# EAGLE design USB_Audio_Interface (EAGLE 9.6.2)
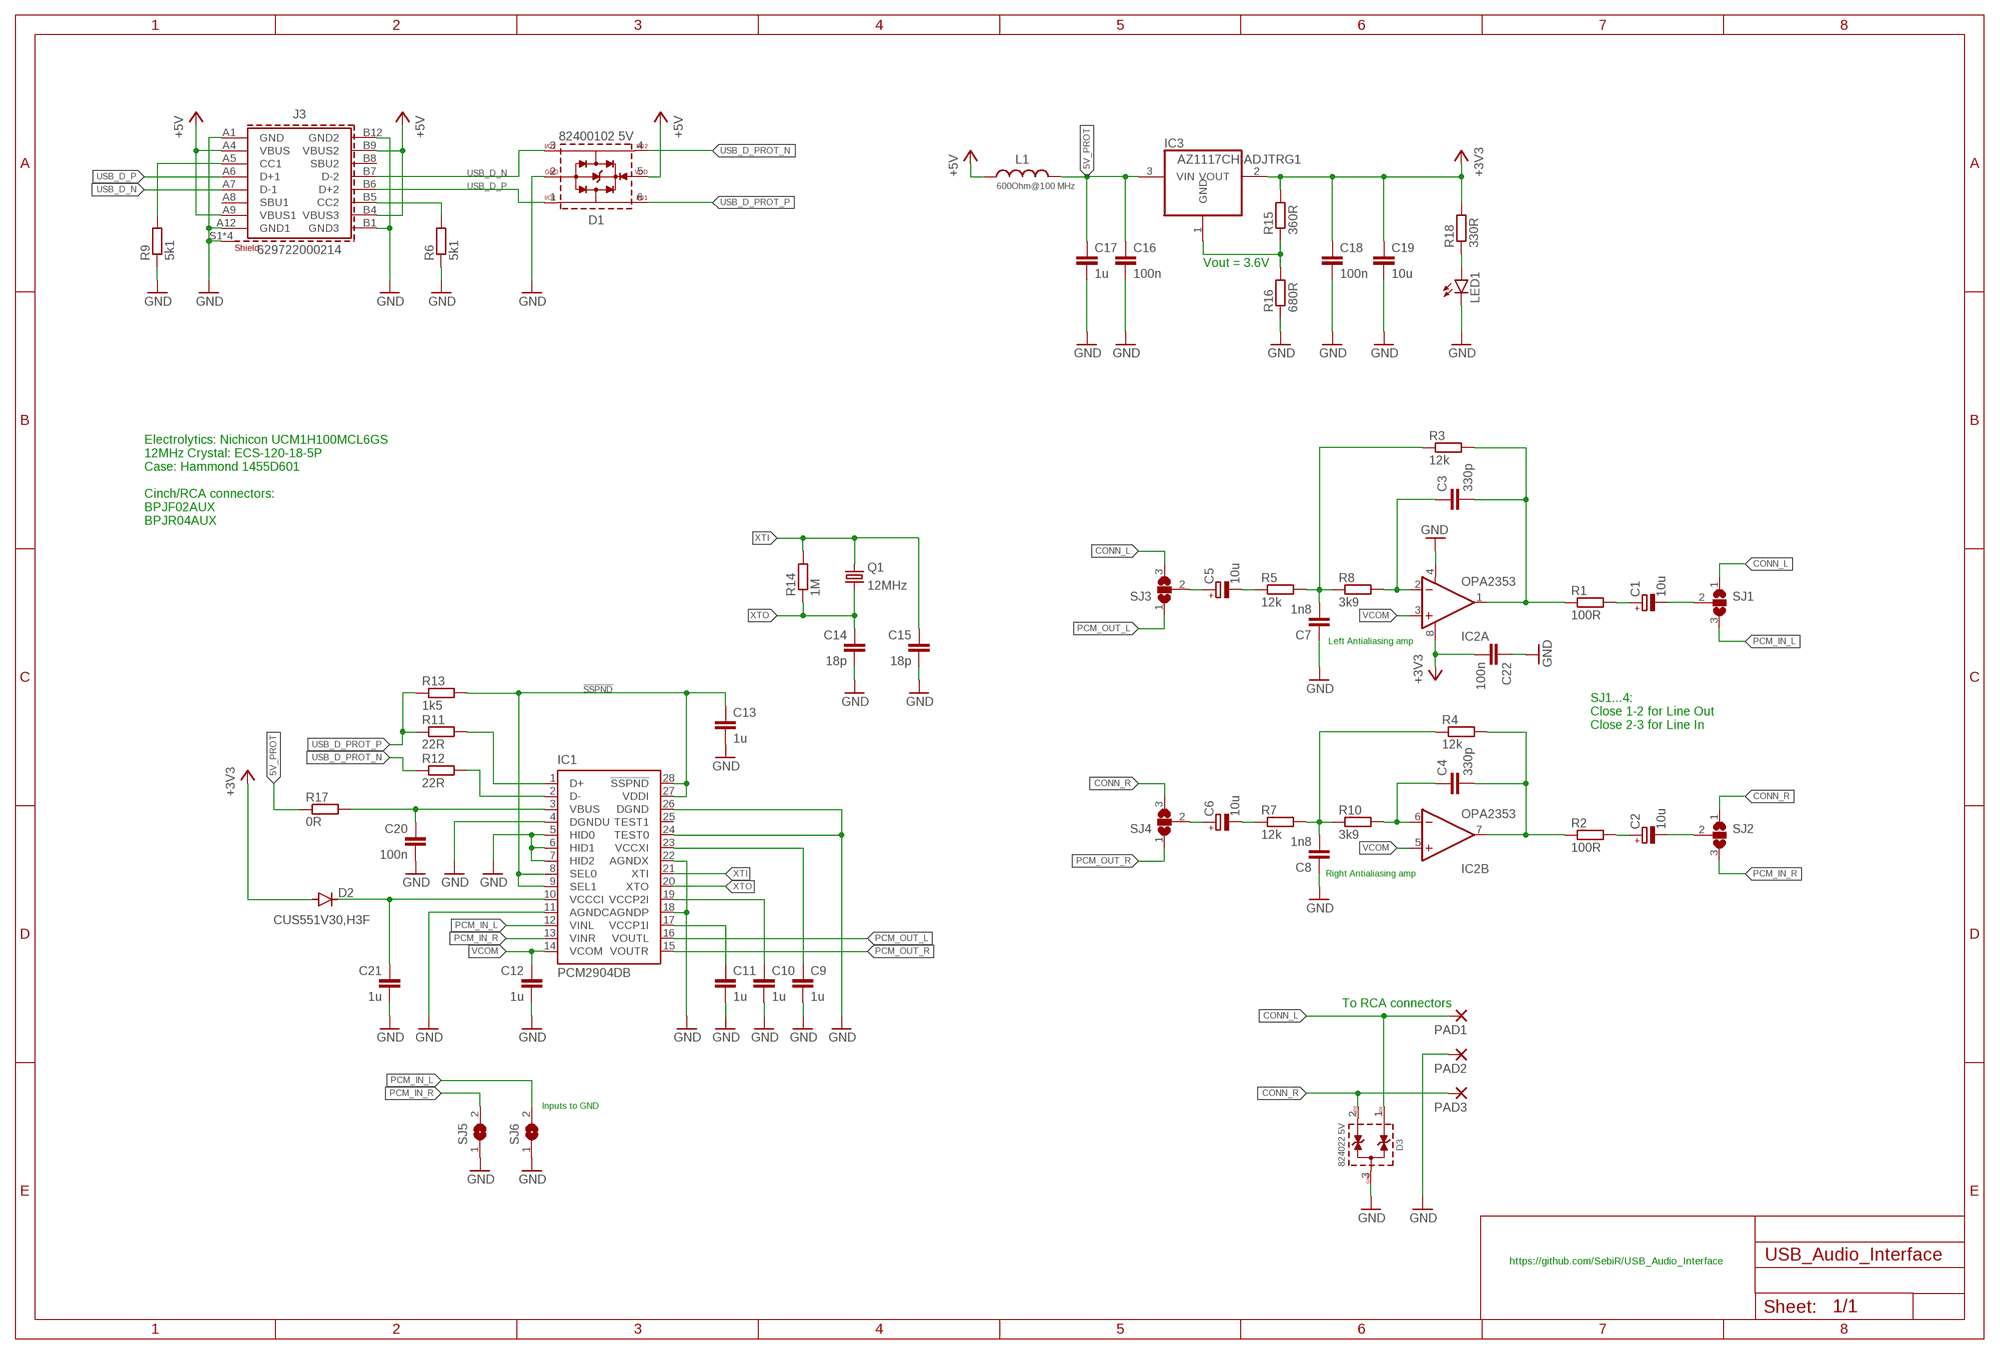
[diagram p0: schematic, sheet 1]

## Parts
C1  10u  CPOL-EUUD-4X5,8  [UD-4X5,8_NICHICON]
C2  10u  CPOL-EUUD-4X5,8  [UD-4X5,8_NICHICON]
C3  330p  C-EUC0603  [C0603]
C4  330p  C-EUC0603  [C0603]
C5  10u  CPOL-EUUD-4X5,8  [UD-4X5,8_NICHICON]
C6  10u  CPOL-EUUD-4X5,8  [UD-4X5,8_NICHICON]
C7  1n8  C-EUC0603  [C0603]
C8  1n8  C-EUC0603  [C0603]
C9  1u  C-EUC0603  [C0603]
C10  1u  C-EUC0603  [C0603]
C11  1u  C-EUC0603  [C0603]
C12  1u  C-EUC0603  [C0603]
C13  1u  C-EUC0603  [C0603]
C14  18p  C-EUC0603  [C0603]
C15  18p  C-EUC0603  [C0603]
C16  100n  C-EUC0603  [C0603]
C17  1u  C-EUC0603  [C0603]
C18  100n  C-EUC0603  [C0603]
C19  10u  C-EUC0603  [C0603]
C20  100n  C-EUC0603  [C0603]
C21  1u  C-EUC0603  [C0603]
C22  100n  C-EUC0603  [C0603]
D1  82400102 5V  WE-TVS-HS_SOT23-6L_82400102  [WE-TVS_SOT23-6L]
D2  CUS551V30,H3F  DIODE-SOD323-R  [SOD323-R]
D3  824022 5V  WE-TVS_SOT23-3L_824022  [WE-TVS_SOT23-3L]
IC1  PCM2904DB  [SSOP28DB]
IC2  OPA2353  OPA2340U  [SO08]
IC3  AZ1117CH-ADJTRG1  REG1117  [SOT223]
J3  629722000214  [629722000214]
L1  600Ohm@100 MHz  WE-CBF_0603_742792651_HC  [WE-CBF_0603_W2.6]
LED1  LEDMICRO-SIDELED  [MICRO-SIDELED]
PAD1  2,15/1,0  [2,15/1,0]
PAD2  2,15/1,0  [2,15/1,0]
PAD3  2,15/1,0  [2,15/1,0]
Q1  12MHz  CRYSTALHC49UP  [HC49UP]
R1  100R  R-EU_R0603  [R0603]
R2  100R  R-EU_R0603  [R0603]
R3  12k  R-EU_R0603  [R0603]
R4  12k  R-EU_R0603  [R0603]
R5  12k  R-EU_R0603  [R0603]
R6  5k1  R-EU_R0603  [R0603]
R7  12k  R-EU_R0603  [R0603]
R8  3k9  R-EU_R0603  [R0603]
R9  5k1  R-EU_R0603  [R0603]
R10  3k9  R-EU_R0603  [R0603]
R11  22R  R-EU_R0603  [R0603]
R12  22R  R-EU_R0603  [R0603]
R13  1k5  R-EU_R0603  [R0603]
R14  1M  R-EU_R0603  [R0603]
R15  360R  R-EU_R0603  [R0603]
R16  680R  R-EU_R0603  [R0603]
R17  0R  R-EU_R0603  [R0603]
R18  330R  R-EU_R0603  [R0603]
SJ1  SJ2W  [SJ_2]
SJ2  SJ2W  [SJ_2]
SJ3  SJ2W  [SJ_2]
SJ4  SJ2W  [SJ_2]
SJ5  SJ  [SJ]
SJ6  SJ  [SJ]

## Nets
5V_PROT: C16.1 C17.1 IC3.3(VIN) L1.2 R17.1
!SSPND: C13.1 IC1.8(SEL0) IC1.9(SEL1) IC1.27(VDDI) IC1.28(!SSPND) R13.2
+3V3: C18.1 C19.1 C22.2 D2.A IC2.8(A:V+) IC3.2(VOUT) R15.2 R18.2
+5V: D1.5(VDD) J3.A4(VBUS) J3.A9(VBUS1) J3.B4(VBUS3) J3.B9(VBUS2) L1.1
CONN_L: D3.1(I/O1) PAD1.1(P) SJ1.1 SJ3.3
CONN_R: D3.2(I/O2) PAD3.1(P) SJ2.1 SJ4.3
GND: C7.1 C8.1 C9.2 C10.2 C11.2 C12.2 C13.2 C14.2 C15.2 C16.2 C17.2 C18.2 C19.2 C20.2 C21.2 C22.1 D1.2(GND) D3.3(GND) IC1.4(DGNDU) IC1.5(HID0) IC1.6(HID1) IC1.7(HID2) IC1.11(AGNDC) IC1.18(AGNDP) IC1.22(AGNDX) IC1.24(TEST0) IC1.26(DGND) IC2.4(A:V-) J3.A1(GND) J3.A12(GND1) J3.B1(GND3) J3.B12(GND2) J3.S1(SHIELD) J3.S2(SHIELD) J3.S3(SHIELD) J3.S4(SHIELD) LED1.C PAD2.1(P) R6.1 R9.1 R16.1 SJ5.1 SJ6.1
N$1: C3.2 IC2.1(A:OUT) R1.1 R3.2
N$2: J3.A5(CC1) R9.2
N$3: C4.2 IC2.7(B:OUT) R2.1 R4.2
N$4: C3.1 IC2.2(A:-IN) R8.2
N$5: J3.B5(CC2) R6.2
N$6: C7.2 R3.1 R5.2 R8.1
N$7: C5.- R5.1
N$8: C1.+ R1.2
N$9: IC3.1(GND) R15.1 R16.2
N$10: LED1.A R18.1
N$11: C2.+ R2.2
N$12: C4.1 IC2.6(B:-IN) R10.2
N$13: C8.2 R4.1 R7.2 R10.1
N$14: C6.- R7.1
N$15: C5.+ SJ3.2
N$17: C20.1 IC1.3(VBUS) R17.2
N$19: C9.1 IC1.23(VCCXI)
N$21: C11.1 IC1.17(VCCP1I)
N$22: C10.1 IC1.19(VCCP2I)
N$25: C21.1 D2.C IC1.10(VCCCI)
N$26: C6.+ SJ4.2
N$27: C1.- SJ1.2
N$28: C2.- SJ2.2
PCM_IN_L: IC1.12(VINL) SJ1.3 SJ6.2
PCM_IN_R: IC1.13(VINR) SJ2.3 SJ5.2
PCM_OUT_L: IC1.16(VOUTL) SJ3.1
PCM_OUT_R: IC1.15(VOUTR) SJ4.1
USB_D_N [USB]: D1.3(I/O2) J3.A7(D-1) J3.B7(D-2)
USB_D_P [USB]: D1.1(I/O1) J3.A6(D+1) J3.B6(D+2)
USB_D_PCM_N [USB]: IC1.2(D-) R12.2
USB_D_PCM_P [USB]: IC1.1(D+) R11.2
USB_D_PROT_N [USB]: D1.4(I/O4) R12.1
USB_D_PROT_P [USB]: D1.6(I/O3) R11.1 R13.1
VCOM: C12.1 IC1.14(VCOM) IC2.3(A:+IN) IC2.5(B:+IN)
XTI: C15.1 IC1.21(XTI) Q1.2 R14.2
XTO: C14.1 IC1.20(XTO) Q1.1 R14.1
Unconnected: IC1.25(TEST1) J3.A8(SBU1) J3.B8(SBU2)

## Notes on the sheet
- Vout = 3.6V
- Electrolytics: Nichicon UCM1H100MCL6GS
  12MHz Crystal: ECS-120-18-5P
  Case: Hammond 1455D601
  
  Cinch/RCA connectors:
  BPJF02AUX
  BPJR04AUX
- Left Antialiasing amp
- SJ1...4:
  Close 1-2 for Line Out
  Close 2-3 for Line In
- Right Antialiasing amp
- To RCA connectors
- Inputs to GND
- https://github.com/SebiR/USB_Audio_Interface

## Library data of the parts
C1 C2 C5 C6 = rcl:CPOL-EU: POLARIZED CAPACITOR, European symbol; SPICEPREFIX: C
C3 C4 C7-C22 = rcl:C-EU: CAPACITOR, European symbol; SPICEPREFIX: C
D1 = Wurth_EMC Components_WE-TVS:WE-TVS-HS_SOT23-6L_82400102: WE-TVS TVS Diode – High Speed Series Characteristics Low clamping voltage Sturdy design Very low capacitance Flow Thru Design for a simple layout Rail to Rail protection Epoxy flame resistant UL94-V0 RoHS, REACH and free of halogens Applications Very fast data lines USB 2.0 Ethernet PoE VGA Sim Cards Keypads HS = High Speed <https://www.we-online.com/catalog/media/o14883v209%20Family_WE-TVS_HIGHSPEED.jpg> Details see: https://www.we-online.com/catalog/en/WE-TVS-HS Updated by Ella Wu 2021-12-16 2021(C) Wurth Elektronik; C-CH: 2pF; CHANNELS: 2+1; DATASHEET-URL: https://www.we-online.com/catalog/datasheet/82400102.pdf; IPEAK: 7A; MOUNT: SMT; PART-NUMBER: 82400102; VALUE: 5Vdc; VBR: 6V
D2 = diode:DIODE-: DIODE
D3 = Wurth_EMC Components_WE-TVS:WE-TVS_SOT23-3L_824022: WE-TVS TVS Diode – Standard Series Characteristics Fast turn-on Low clamping voltage High ESD withstand voltage Uni- or bidirectional protection Small package Epoxy flame resistant UL94 V-0 Applications DC power supply USB Power Delivery (PD) Headsets and accessories PDAs Digital cameras MP3-Player Touch Panels Notebooks ESD, EFT and Surge Protection ESD protection in accordance with EN 61000-4-2 – 8 kV contact discharge – 15 kV air discharge <https://www.we-online.com/catalog/media/o106433v209%20Family_WE-TVS_Standard.jpg> Details see: https://www.we-online.com/catalog/en/WE-TVS Updated by Ella Wu 2021-12-16 2021(C) Wurth Elektronik; C-CH: 12pF; CHANNELS: 2; DATASHEET-URL: https://www.we-online.com/catalog/datasheet/824022.pdf; IPEAK: 8A; MOUNT: SMT; PART-NUMBER: 824022; VALUE: 5Vdc; VBR: 6.1V
IC1 = texas:PCM29*: STEREO AUDIO CODEC WITH USB INTERFACE SINGLE-ENDED ANALOG INPUT/OUTPUT AND S/PDIF; MF: TEXAS INSTRUMENT CONNECTORS; MPN: PCM2904DB; OC_FARNELL: 1207091; OC_NEWARK: 75C5386
IC2 = burr-brown:OPA2340: Single-Supply, Rail-to-Rail Operational Amplifiers MicroAmplifier(TM) Series; Product Folder:OPA2340; MANUFACTURER: TEXAS INSTRUMENTS; MPN: OPA2340UA
IC3 = burr-brown:REG1117: 800mA and 1A Low Dropout (LDO) Positive Regulator 1.8V, 2.5V, 2.85V, 3.3V, 5V, and Adj; MPN: REG1117
J3 = Wurth_Connectors_WR-USB:629722000214: WR-COM USB 2.0 Type C Receptacle Horizontal SMT Kind Properties Durability 10 000 Mating cycles Gender Receptacle Type Horizontal General Information Operating Temperature -40 up to +85 °C Electrical Properties Working Voltage 20 V (DC) Withstanding Voltage 100 V (AC) Contact Resistance 40 mΩ Material Properties Insulator Material LCP Insulator Flammability Rating UL94 V-0 Insulator Color Black Contact Material Brass Contact Plating Gold over Nickel Contact Type Stamped Shielding Material Steel Shielding Plating Nickel (Ni) <https://www.we-online.com/components/media/o689297v209%20family-wr-com-629722000214.jpg> Details see: www.we-online.com/en/components/products/WR-COM_USB_20_TYPE_C_RECEPTACLE_HORIZONTAL_SMT <www.we-online.com/catalog/WR-COM_USB_20_TYPE_C_RECEPTACLE_HORIZONTAL_SMT/?utm_source=eagle_model&utm_medium=description_link&utm_campaign=eisos_eagle> Updated by Ella Wu 2023-05-30 2023 (C) Würth Elektronik; APPLICATION: USB 2.0; DATASHEET-URL: https://www.we-online.com/redexpert/spec/629722000214?ae; GERDER: Receptacle; INTERFACE-TYPE: Type C; IR: 5A; MOUNT: SMT; PACKAGING: Tape and Reel; PART-NUMBER: 629722000214; PINS: 16; TYPE: Horizontal; WORKING-VOLTAGE: 20V(AC)
L1 = Wurth_EMC Components_WE-CBF:WE-CBF_0603: WE-CBF SMD EMI Suppression Ferrite Bead Characteristics Reliable Ni-Sn electrodes High rated current up to 6 A Operating temperature: –55 ºC to +125 ºC Applications Perfect as data lined filter and for uncoupling of distribution voltage Package name and Variant abbreviation: Package: Wide Band /High Speed: W=Width= 2.2 High Current: W=Width= 2.6 Variant abbreviation: WB = Wide Band HS=High Speed HC=High Current <https://www.we-online.com/catalog/media/o14753v209%20Family_WE-CBF.jpg> Details see: www.we-online.com/katalog/WE-CBF <www.we-online.com/catalog/WE-CBF/?utm_source=eagle_model&utm_medium=description_link&utm_campaign=eisos_eagle> Updated by Ella Wu 2022-11-02 2022(C) Wurth Elektronik; DATASHEET-URL: https://www.we-online.com/redexpert/spec/742792651?ae; IR2: 1000mA; MOUNT: SMT; PART-NUMBER: 742792651; RDC-MAX: 0.2Ohm; TYPE: High Current; Z-MAX: 800Ohm@200 MHz
LED1 = led:LED: LED OSRAM: - CHIPLED LG R971, LG N971, LY N971, LG Q971, LY Q971, LO R971, LY R971 LH N974, LH R974 LS Q976, LO Q976, LY Q976 LO Q996 - Hyper CHIPLED LW Q18S LB Q993, LB Q99A, LB R99A - SideLED LS A670, LO A670, LY A670, LG A670, LP A670 LB A673, LV A673, LT A673, LW A673 LH A674 LY A675 LS A676, LA A676, LO A676, LY A676, LW A676 LS A679, LY A679, LG A679 - Hyper Micro SIDELED® LS Y876, LA Y876, LO Y876, LY Y876 LT Y87S - SmartLED LW L88C, LW L88S LB L89C, LB L89S, LG L890 LS L89K, LO L89K, LY L89K LS L896, LA L896, LO L896, LY L896 - TOPLED LS T670, LO T670, LY T670, LG T670, LP T670 LSG T670, LSP T670, LSY T670, LOP T670, LYG T670 LG T671, LOG T671, LSG T671 LB T673, LV T673, LT T673, LW T673 LH T674 LS T676, LA T676, LO T676, LY T676, LB T676, LH T676, LSB T676, LW T676 LB T67C, LV T67C, LT T67C, LS T67K, LO T67K, LY T67K, LW E67C LS E67B, LA E67B, LO E67B, LY E67B, LB E67C, LV E67C, LT E67C LW T67C LS T679, LY T679, LG T679 LS T770, LO T770, LY T770, LG T770, LP T770 LB T773, LV T773, LT T773, LW T773 LH T774 LS E675, LA E675, LY E675, LS T675 LS T776, LA T776, LO T776, LY T776, LB T776 LHGB T686 LT T68C, LB T68C - Hyper Mini TOPLED® LB M676 - Mini TOPLED Santana® LG M470 LS M47K, LO M47K, LY M47K Source: http://www.osram.convergy.de LUXEON: - LUMILED® LXK2-PW12-R00, LXK2-PW12-S00, LXK2-PW14-U00, LXK2-PW14-V00 LXK2-PM12-R00, LXK2-PM12-S00, LXK2-PM14-U00 LXK2-PE12-Q00, LXK2-PE12-R00, LXK2-PE12-S00, LXK2-PE14-T00, LXK2-PE14-U00 LXK2-PB12-K00, LXK2-PB12-L00, LXK2-PB12-M00, LXK2-PB14-N00, LXK2-PB14-P00, LXK2-PB14-Q00 LXK2-PR12-L00, LXK2-PR12-M00, LXK2-PR14-Q00, LXK2-PR14-R00 LXK2-PD12-Q00, LXK2-PD12-R00, LXK2-PD12-S00 LXK2-PH12-R00, LXK2-PH12-S00 LXK2-PL12-P00, LXK2-PL12-Q00, LXK2-PL12-R00 Source: www.luxeon.com KINGBRIGHT: KA-3528ASYC Source: www.kingbright.com
PAD1-PAD3 = wirepad:2,15/1,0: THROUGH-HOLE PAD
Q1 = crystal:CRYSTAL: CRYSTAL; OC_FARNELL: unknown; OC_NEWARK: unknown
R1-R18 = rcl:R-EU_: RESISTOR, European symbol; SPICEPREFIX: R
SJ1-SJ4 = jumper:SJ2W: SMD solder JUMPER
SJ5 SJ6 = jumper:SJ: SMD solder JUMPER

## Net classes
1 USB: clearance 0.5 mm to class 0

## Board
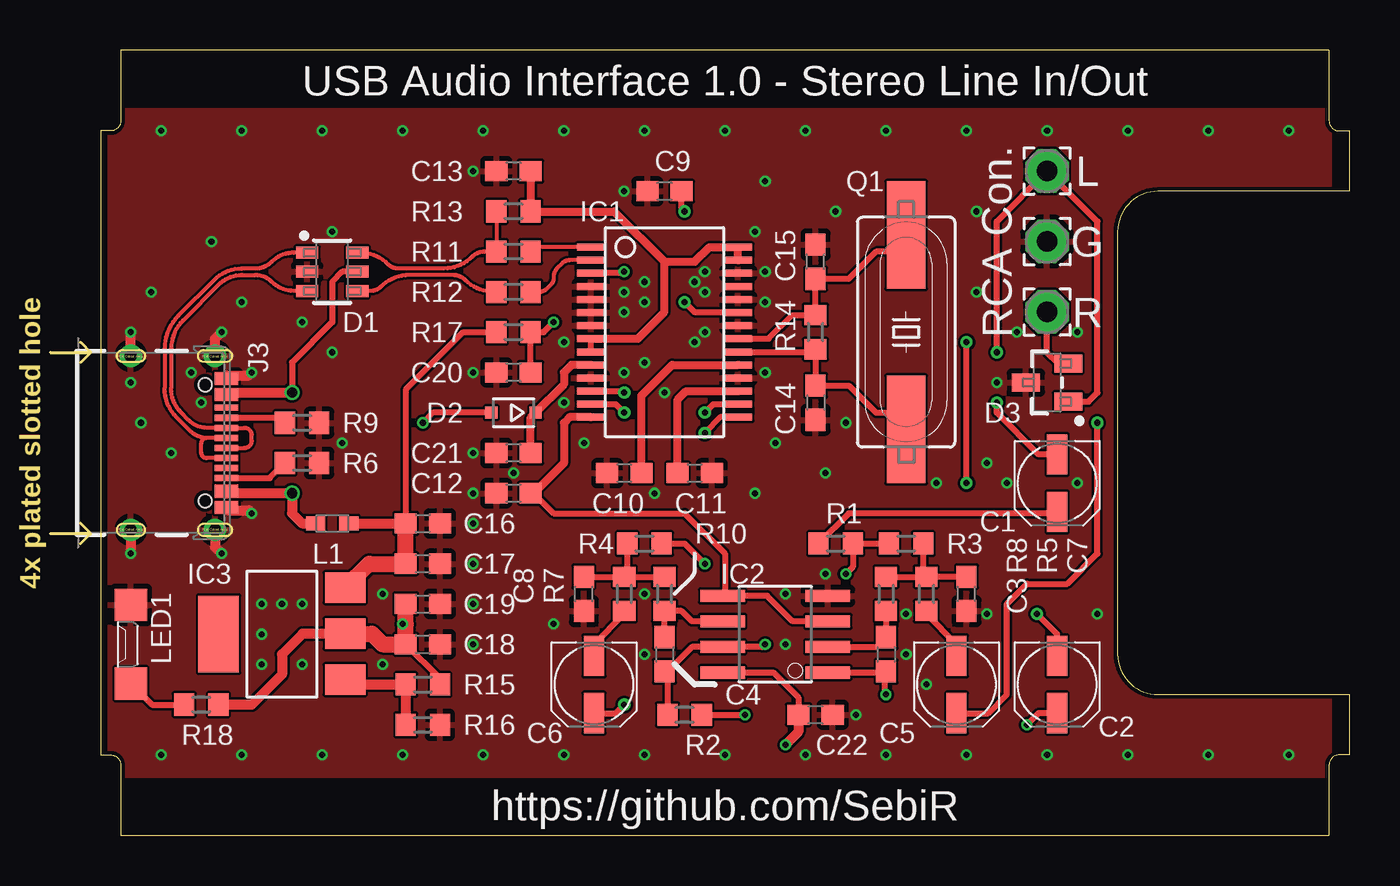
[diagram p1: board, top side]
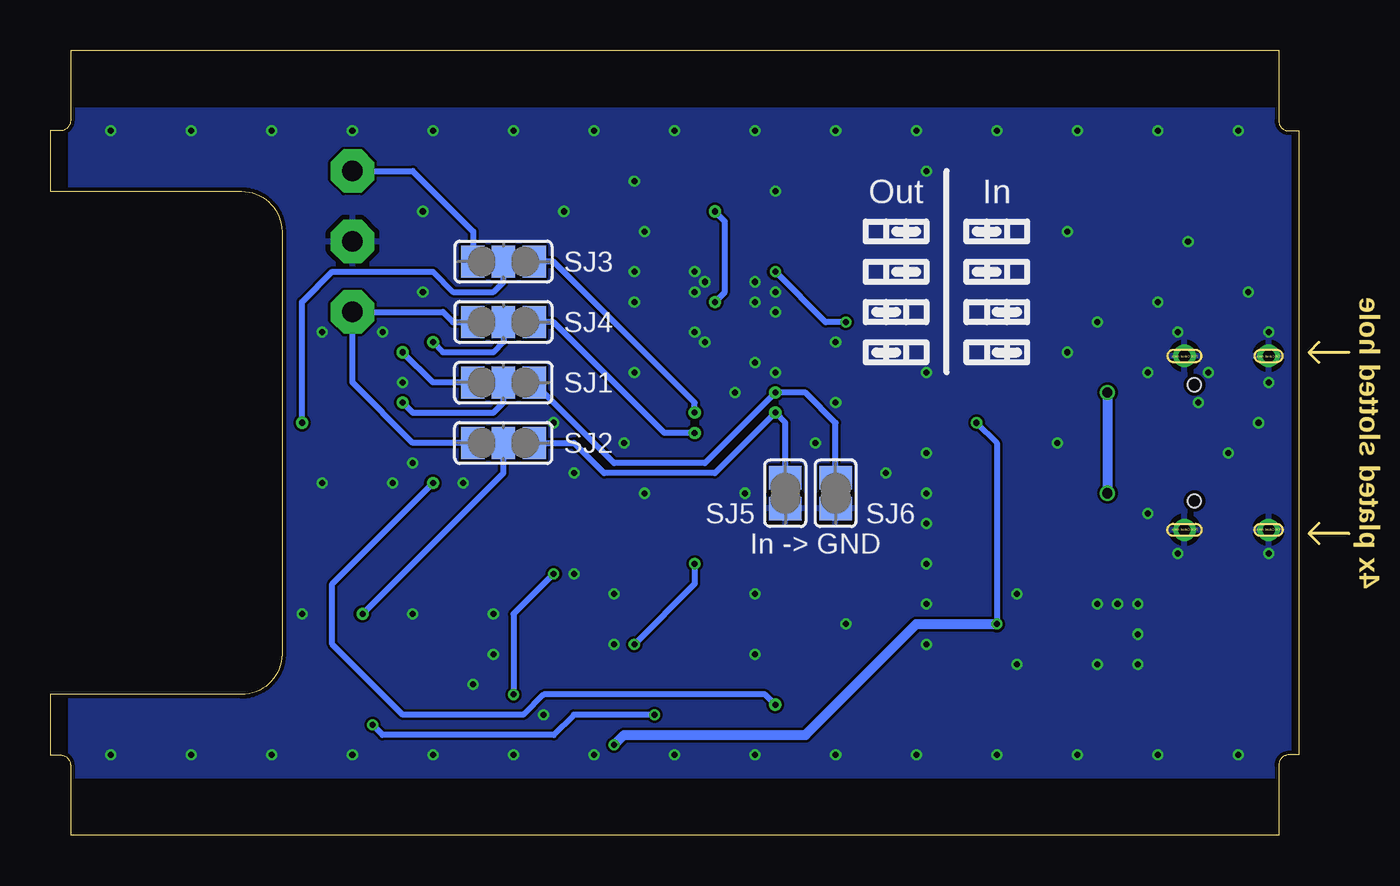
[diagram p2: board, bottom side, seen from below]

Size 64.5 x 39 mm. Coordinates in mm from the lower left corner, seen from the top.
Outline: 0,15 2,15
Outline: 2,15 1.5,14.5
Outline: 1.5,15.5 2,15
Outline: 2,24 1.5,23.5
Outline: 1.5,24.5 2,24
Outline: 0,24 2,24
Outline: 3.5,0 63.5,0 63.5,3.5 arc-90 64,4 64.5,4 64.5,7 55,7 arc-90 53,9 53,30 arc-90 55,32 64.5,32 64.5,35 64,35 arc-90 63.5,35.5 63.5,39 3.5,39 3.5,35.5 arc-90 3,35 2.5,35 2.5,4 3,4 arc-90 3.5,3.5 3.5,0
Copper layers (1*16): Top 0.035mm / dielectric 1.6mm / Bottom 0.035mm
Design rules "jlcpcb-2layers": minimum track width 0.2mm, minimum drill 0.3mm, track to track 5mil, track to pad 5mil, pad to pad 5mil, via to via 5mil, smd to smd 5mil, copper to edge 0.2mm, drill to drill 6mil, minimum pad ring 10mil, minimum via ring 0.125mm, stop-mask expansion 4mil, vias tented up to drill 0.5mm, thermal gap 10mil
tKeepout: area 3.5,36 to 63.5,39; area 3.5,0 to 63.5,3
bKeepout: area 3.5,0 to 63.5,3; area 3.5,36 to 63.5,39

### Footprints (pad centres in the part's own frame; a part is rotated, then mirrored left to right if it is on the bottom)
UD-4X5,8_NICHICON = smd 2 x 1: + 1.425,0; - -1.425,0
C0603 = smd 1.1 x 1: 1 -0.85,0; 2 0.85,0
WE-TVS_SOT23-6L = smd 0.6 x 1.1: 1 -0.95,-1.25; 2 0,-1.25; 3 0.95,-1.25; 4 0.95,1.25; 5 0,1.25; 6 -0.95,1.25
SOD323-R = smd 0.6 x 0.6: A 1.1,0; C -1.1,0
WE-TVS_SOT23-3L = smd 0.9 x 1.4: 1 -0.95,-1.05; 2 0.95,-1.05; 3 0,1.05
SSOP28DB = smd 0.348 x 1.397: 1 -4.225,-3.656; 2 -3.575,-3.656; 3 -2.925,-3.656; 4 -2.275,-3.656; 5 -1.625,-3.656; 6 -0.975,-3.656; 7 -0.325,-3.656; 8 0.325,-3.656; 9 0.975,-3.656; 10 1.625,-3.656; 11 2.275,-3.656; 12 2.925,-3.656; 13 3.575,-3.656; 14 4.225,-3.656; 15 4.225,3.656; 16 3.575,3.656; 17 2.925,3.656; 18 2.275,3.656; 19 1.625,3.656; 20 0.975,3.656; 21 0.325,3.656; 22 -0.325,3.656; 23 -0.975,3.656; 24 -1.625,3.656; 25 -2.275,3.656; 26 -2.925,3.656; 27 -3.575,3.656; 28 -4.225,3.656
SO08 = smd 0.61 x 2.21: 1 -1.905,-2.616; 2 -0.635,-2.616; 3 0.635,-2.616; 4 1.905,-2.616; 5 1.905,2.616; 6 0.635,2.616; 7 -0.635,2.616; 8 -1.905,2.616
SOT223 = smd 1.499 x 2.007: 1 -2.261,-3.15; 2 0.025,-3.15; 3 2.311,-3.15 | smd 3.81 x 2.007: 4 0,3.15
629722000214 = smd 0.3 x 1.15: A1 -3.35,4.745; A4 -2.55,4.745; A5 -1.25,4.745; A6 -0.25,4.745; A7 0.25,4.745; A8 1.25,4.745; A9 2.55,4.745; A12 3.35,4.745; B1 3.05,4.745; B4 2.25,4.745; B5 1.75,4.745; B6 0.75,4.745; B7 -0.75,4.745; B8 -1.75,4.745; B9 -2.25,4.745; B12 -3.05,4.745 | drill 0.6 pad 1: S1 -4.32,4.18; S2 4.32,4.18; S3 -4.32,0; S4 4.32,0 | hole 0.65: -2.89,3.68; 2.89,3.68
WE-CBF_0603_W2.6 = smd 0.95 x 0.7: 1 -0.825,0; 2 0.825,0
MICRO-SIDELED = smd 1.6 x 1.6: A 0,1.95; C 0,-1.95
2,15/1,0 = drill 1.016 pad 2.159 octagon: 1 0,0
HC49UP = smd 5.334 x 1.93: 1 -4.826,0; 2 4.826,0
R0603 = smd 1 x 1.1: 1 -0.85,0; 2 0.85,0
SJ_2 = smd 1.168 x 1.6: 1 -1.524,0; 2 0,0; 3 1.524,0
SJ = smd 1.168 x 1.6: 1 -0.762,0; 2 0.762,0

### Placement (x,y rotation side)
C1  50,17.5 270 top
C2  50,7.5 270 top
C3  41.5,9 270 top
C4  30.5,9 270 top
C5  45,7.5 270 top
C6  27,7.5 270 top
C7  45.5,12 90 top
C8  26.5,12 90 top
C9  30.5,32 180 top
C10  28.5,18 180 top
C11  32,18 0 top
C12  23,17 180 top
C13  23,33 180 top
C14  38,21.5 270 top
C15  38,28.5 90 top
C16  18.5,15.5 0 top
C17  18.5,13.5 0 top
C18  18.5,9.5 0 top
C19  18.5,11.5 0 top
C20  23,23 180 top
C21  23,19 180 top
C22  38,6 180 top
D1  14,28 270 top
D2  23,21 180 top
D3  49.5,22.5 90 top
IC1  30.5,25 270 top
IC2  36,10 90 top
IC3  11.5,10 90 top
J3  4,19.5 270 top
L1  742792651  [WE-CBF_0603_W2.6]  14,15.5 0 top
LED1  4,9.5 180 top
PAD1  49.5,33 0 top
PAD2  49.5,29.5 0 top
PAD3  49.5,26 0 top
Q1  42.5,25 90 top
R1  39,14.5 180 top
R2  31.5,6 0 top
R3  42.5,14.5 180 top
R4  29.5,14.5 0 top
R5  43.5,12 90 top
R6  12.5,18.5 180 top
R7  28.5,12 90 top
R8  41.5,12 270 top
R9  12.5,20.5 180 top
R10  30.5,12 270 top
R11  23,29 0 top
R12  23,27 0 top
R13  23,31 0 top
R14  38,25 90 top
R15  18.5,7.5 0 top
R16  18.5,5.5 180 top
R17  23,25 0 top
R18  7.5,6.5 0 top
SJ1  42,22.5 0 bottom
SJ2  42,19.5 0 bottom
SJ3  42,28.5 180 bottom
SJ4  42,25.5 180 bottom
SJ5  28,17 90 bottom
SJ6  25.5,17 90 bottom

### Tracks (layer width: path | path; a pad name or v marks a point on that pad's centre or on a via)
5V_PROT
  Top 0.3: R17.1 20.5,25 17.65,22.15 C16.1
  Top 0.5: L1.2 C16.1
  Top 0.8: C16.1 C17.1 15.84,13.5 IC3.3
!SSPND
  Top 0.3: IC1.9 IC1.8
  Top 0.4: IC1.8 29.18,24.68 30.5,26 30.5,28.5 | 30.5,28.5 32,28.5 32.73,29.23 IC1.28 IC1.27 | 30.5,28.5 28,31 R13.2 C13.1
+3V3  (via drill 0.3)
  Top 0.3: IC2.8 35.91,8.1 37.15,6.85 C22.2 | R15.2 19.35,7.8 C18.1 | D2.A 19,21 v18.5,20.5
  Top 0.5: IC3.2 12.53,10.03 11.5,9 11.5,8 10,6.5 R18.2 | C22.2 37.15,5.15 v36.5,4.5 | v17.5,10.5 17.65,10.5
  Top 0.8: IC3.2 15.97,10.03 16.5,9.5 C18.1 17.65,10.5 C19.1
  Bottom 0.3: v18.5,20.5 17.5,19.5 v17.5,10.5
  Bottom 0.5: v36.5,4.5 36,5 27,5 21.5,10.5 v17.5,10.5
+5V  (via drill 0.5)
  Top 0.2: 8.75,22 J3.A4 8.79,22 9,22
  Top 0.3: J3.B4 8.75,17 J3.A9 | 8.75,22 J3.B9 | D1.5 14.5,28 14,27.5 14,25.5 12,23.5 v12,22
  Top 0.5: 9,22 v12,22 | 8.75,17 8.75,16.98 8.78,16.98 8.79,17 v12,17 12,16 12.5,15.5 L1.1
  Bottom 0.5: v12,22 v12,17
CONN_L  (via drill 0.3 pad 0.6)
  Top 0.3: D3.1 51.55,21.55 52,22 52,30.5 PAD1.1 47,30.5 v47,24
  Bottom 0.3: PAD1.1 46.5,33 43.5,30 43.5,28.52 SJ3.3 | SJ1.1 45.5,22.5 v47,24
CONN_R
  Top 0.3: D3.2 50.05,23.45 49.5,24 PAD3.1
  Bottom 0.3: SJ4.3 44.5,25.5 45,26 PAD3.1 49.5,22.5 46.5,19.5 SJ2.1
GND  (via drill 0.3)
  Top 0.3: J3.B12 J3.A1 | J3.B1 J3.A12
  Top 0.5: J3.S4 v4,14 | J3.S2 8.18,14.32 v8.5,14 | J3.S3 v4,25 | J3.S1 8.18,24.68 v8.5,25 | J3.A1 9.85,22.85 v10,23 | J3.A12 9.85,16.15 v10,16
  other vias: 5.5,4 9.5,4 13.5,4 17.5,4 21.5,4 25.5,4 29.5,4 33.5,4 37.5,4 41.5,4 45.5,4 49.5,4 53.5,4 57.5,4 61.5,4 5.5,35 9.5,35 13.5,35 17.5,35 21.5,35 25.5,35 29.5,35 33.5,35 37.5,35 41.5,35 45.5,35 49.5,35 53.5,35 57.5,35 61.5,35 32.5,28 32.5,27 32,27.5 35,30 28.5,26 28.5,27 29.5,26.5 29.5,27.5 25.5,24.5 28.5,23 35.5,23 30,17 30.5,22 29.5,23.5 40,6 36.5,9.5 36.5,12 38.5,13 25,10.5 29.5,12 29.5,9 42.5,11 42.5,9 46.5,11 26.5,19.5 35,17 21,19 21,17 21,23 21,33 28.5,32 21,9.5 21,11.5 21,13.5 21,15.5 14,24 14.5,19.5 35.5,26.5 32,24.5 32.5,25 35.5,28 23,18 25.5,21.5 12.5,25.5 46,31 48,25 47,22.5 39.5,20.5 51,17.5 47.5,17.5 52,11 43.5,7.5 36,19.5 39,31 38.5,18 44,17.5 46.5,18.5 35.5,32.5 46,27 51,25 14,30 8,29.5 5,27 10.5,11.5 10.5,10 10.5,8.5 11.5,11.5 12.5,11.5 12.5,8.5 16.5,8.5 16.5,12 9.5,26.5 6,19 4.5,20.5 4,22.5 7.5,21.5 7,23
  pour Top (rank 6): 3,36 63.5,36 63.5,3 3,3
  pour Bottom: 3,36 63.5,36 63.5,3 3,3
N$1  (via drill 0.3)
  Top 0.3: IC2.1 41.45,8.1 | 41.45,8.1 C3.2 | R3.2 R1.1 39.85,13.35 v39.5,13 | v41.5,7 41.45,7.05 41.45,8.1
  Bottom 0.3: v39.5,13 41.5,11 v41.5,7
N$2
  Top 0.3: J3.A5 11.6,20.75 11.63,20.52 R9.2
N$3  (via drill 0.3)
  Top 0.3: R4.2 31.5,14.5 v32.5,13.5 | v35.5,9.5 35.36,9.37 IC2.7 31.86,9.37 30.65,8.15 C4.2 30.65,8 R2.1
  Bottom 0.3: v32.5,13.5 32.5,12.5 v35.5,9.5
N$4
  Top 0.3: IC2.2 41.02,9.37 C3.1 R8.2
N$5
  Top 0.3: J3.B5 10.9,17.75 R6.2
N$6
  Top 0.3: R5.2 43.35,13 R3.1 | R8.1 R5.2 | C7.2 R5.2
N$7
  Top 0.3: R5.1 43.5,11 45,9.5 C5.-
N$8
  Top 0.3: C1.+ 50,16 39.65,16 R1.2
N$9
  Top 0.5: IC3.1 14.89,7.5 R15.1 R16.2
N$10
  Top 0.3: LED1.A 5.05,6.5 R18.1
N$11  (via drill 0.3)
  Top 0.3: C2.+ 49.08,6.08 v48.5,5.5 | R2.2 v34.5,6
  Bottom 0.3: v34.5,6 38.5,6 39.5,5 48,5 v48.5,5.5
N$12
  Top 0.3: IC2.6 31.86,10.63 31.35,11.15 R10.2 C4.1
N$13
  Top 0.3: R4.1 28.65,13 R7.2 | R7.2 R10.1 | C8.2 R7.2
N$14
  Top 0.3: R7.1 28.5,11 27,9.5 C6.-
N$15  (via drill 0.3 pad 0.6)
  Top 0.3: C5.+ 46.58,6.08 47.5,7 47.5,11.5 48.5,12.5 50.5,12.5 52,14 v52,20.5
  Bottom 0.3: v52,20.5 52,26.5 50.5,28 45.5,28 44.5,27 42.5,27 42,27.5 SJ3.2
N$17  (via drill 0.3)
  Top 0.3: C20.1 R17.2 24.5,25 v25,25.5 | v28.5,28 28.43,27.93 IC1.3
  Bottom 0.3: v25,25.5 26,25.5 v28.5,28
N$19  (via drill 0.3 pad 0.6)
  Top 0.3: IC1.23 32.02,25.98 v31.5,26.5 | v31.5,31 31.35,31.15 C9.1
  Bottom 0.3: v31.5,26.5 31,27 31,30.5 v31.5,31
N$21
  Top 0.4: C11.1 31.15,21.65 31.57,22.07 IC1.17
N$22
  Top 0.4: C10.1 29.35,21.85 30.88,23.38 IC1.19
N$25
  Top 0.4: IC1.10 25.88,23.38 25.5,23 25.5,22.4 D2.C 23.85,20.75 C21.1
N$26  (via drill 0.3 pad 0.6)
  Top 0.3: C6.+ 28.07,6.08 v28.5,6.5 | v45.5,17.5 v45.5,24.5
  Bottom 0.3: v28.5,6.5 29,7 40,7 41,6 47,6 50.5,9.5 50.5,12.5 v45.5,17.5 | SJ4.2 42,24.5 42.5,24 45,24 v45.5,24.5
N$27  (via drill 0.3 pad 0.6)
  Top 0.3: C1.- 49.08,18.93 47,21 v47,21.5
  Bottom 0.3: v47,21.5 46.5,21 42.5,21 42,21.5 SJ1.2
N$28  (via drill 0.3 pad 0.6)
  Top 0.3: C2.- 50,10 v49,11
  Bottom 0.3: SJ2.2 42,18 v49,11
PCM_IN_L  (via drill 0.3 pad 0.6)
  Top 0.3: IC1.12 28.43,22.07 v28.5,22
  Bottom 0.3: SJ1.3 40.48,22.48 36.5,18.5 32,18.5 v28.5,22 27,22 25.5,20.5 SJ6.2
PCM_IN_R  (via drill 0.3 pad 0.6)
  Top 0.3: IC1.13 28.07,21.43 v28.5,21
  Bottom 0.3: SJ2.3 38.5,19.5 37,18 31.5,18 v28.5,21 28,20.5 SJ5.2
PCM_OUT_L  (via drill 0.3 pad 0.6)
  Top 0.3: v32.5,21 32.92,21.43 IC1.16
  Bottom 0.3: v32.5,21 32.5,21.5 39.5,28.5 SJ3.1
PCM_OUT_R  (via drill 0.3 pad 0.6)
  Top 0.3: IC1.15 33.27,20.77 v32.5,20
  Bottom 0.3: v32.5,20 34,20 39.5,25.5 SJ4.1
USB_D_N
  Top 0.2: J3.A7 9.65,19.25 arc90 10,19.6 10,19.9 arc90 9.65,20.25 J3.B7 7.77,20.25 arc-45 6.88,20.62 6.5,21 arc-45 6,22.21 6,24.17 arc-45 6.59,25.59 8.37,27.37 arc-45 9.5,27.84 9.53,27.84 arc-45 9.53,27.84 10.19,27.84 arc-45 11,27.5 arc45 12.09,27.05 D1.3
USB_D_P
  Top 0.2: J3.A6 7.77,19.75 | 7.77,19.75 arc-45 6.95,20.09 6.27,20.77 arc-45 5.67,22.21 5.67,24.17 arc-45 6.36,25.82 8.14,27.6 arc-45 9.5,28.16 9.53,28.16 | J3.B6 7.75,18.75 arc-90 7.5,19 7.5,19.48 arc-90 7.77,19.75 | 9.53,28.16 10.19,28.16 arc45 11,28.5 arc-45 12.09,28.95 D1.1 | 9.53,28.16 arc-45 9.53,28.16
USB_D_PCM_N
  Top 0.2: IC1.2 25.78,28.57 arc45 25.43,28.43 25.15,28.15 arc45 25,27.79 25,27.71 arc-45 24.85,27.35 24.65,27.15 arc-45 24.29,27
  Top 0.3: 24.29,27 R12.2
USB_D_PCM_P
  Top 0.2: IC1.1 24.07,29.23
  Top 0.3: 24.07,29.23 R11.2
USB_D_PROT_N
  Top 0.2: D1.4 15.92,27.05 arc45 16.4,27.25 arc-45 17.81,27.84 20.01,27.84 arc-45 20.61,27.59 arc45 22.03,27 R12.1
USB_D_PROT_P
  Top 0.2: R13.1 R11.1 21.55,29 arc45 20.95,28.75 arc-45 19.54,28.16 17.27,28.16 arc-45 16.79,28.36 arc45 15.37,28.95 D1.6
VCOM
  Top 0.3: IC2.3 36.87,10.63 35.59,11.9 33.5,11.9 | 33.5,11.9 IC2.5 | 33.5,11.9 33.5,14 31.5,16 25,16 24,17
  Top 0.4: C12.1 24,17 25.5,18.5 25.5,20.5 25.77,20.77 IC1.14
XTI
  Top 0.3: IC1.21 35.67,24.68 36.85,25.85 R14.2 C15.1 39.65,27.65 41,29 42,29 42.5,29.5 Q1.2
XTO
  Top 0.3: Q1.1 42.5,21 41,21 39.65,22.35 C14.1 R14.1 37.88,24.02 IC1.20

### Text on the board
Dimension: 4x plated slotted hole
tPlace: USB Audio Interface 1.0 - Stereo Line In/Out | L | RCA Con. | G | R | https://github.com/SebiR
bPlace: In | Out | In -> GND